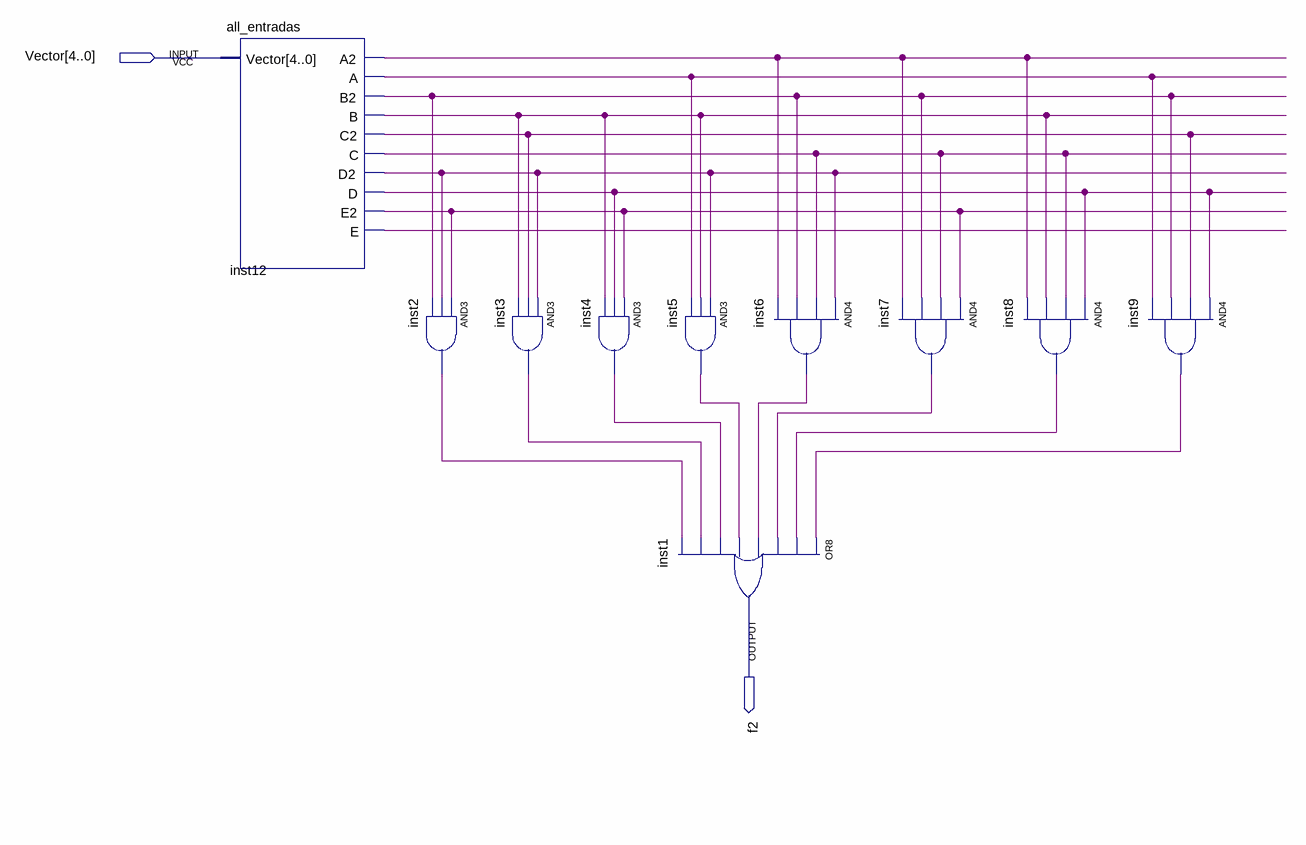
[diagram p0: schematic sheet]
// Quartus schematic f2.bdf as structural Verilog: 10 symbols, 2 pins
module f2 (
  input  [4:0] Vector,
  output f2
);

  wire inst2_out, inst3_out, inst4_out, inst5_out, inst6_out, inst7_out, inst8_out, inst9_out, inst12_a,
       inst12_a2, inst12_b, inst12_b2, inst12_c, inst12_c2, inst12_d, inst12_d2, inst12_e, inst12_e2;

  all_entradas inst12 (
    .Vector(Vector), .A2(inst12_a2), .A(inst12_a), .B2(inst12_b2), .B(inst12_b), .C2(inst12_c2),
    .C(inst12_c), .D2(inst12_d2), .D(inst12_d), .E2(inst12_e2), .E(inst12_e));
  and inst2 (inst2_out, inst12_e2, inst12_d2, inst12_b2);
  and inst3 (inst3_out, inst12_d2, inst12_c2, inst12_b);
  and inst4 (inst4_out, inst12_e2, inst12_d, inst12_b);
  or inst1 (f2, inst9_out, inst8_out, inst7_out, inst6_out, inst5_out, inst4_out, inst3_out, inst2_out);
  and inst5 (inst5_out, inst12_d2, inst12_b, inst12_a);
  and inst6 (inst6_out, inst12_d2, inst12_c, inst12_b2, inst12_a2);
  and inst7 (inst7_out, inst12_e2, inst12_c, inst12_b2, inst12_a2);
  and inst8 (inst8_out, inst12_d, inst12_c, inst12_b, inst12_a2);
  and inst9 (inst9_out, inst12_d, inst12_c2, inst12_b2, inst12_a);
endmodule
